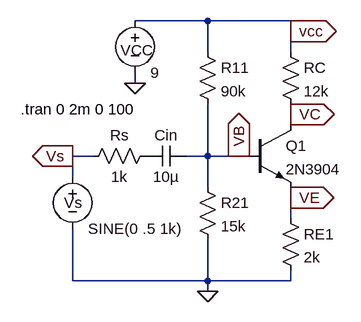
[diagram p0: schematic lab_CE_Q1_stage - GOOD.asc]
lab_CE_Q1_stage - GOOD.asc, the LTspice schematic file:
Version 4
SHEET 1 880 680
WIRE 256 -96 144 -96
WIRE 384 -96 256 -96
WIRE 384 -80 384 -96
WIRE 256 -48 256 -96
WIRE 384 -48 384 -80
WIRE 144 0 144 -16
WIRE 384 48 384 32
WIRE 384 64 384 48
WIRE 80 112 48 112
WIRE 256 112 256 32
WIRE 256 112 224 112
WIRE 304 112 256 112
WIRE 320 112 304 112
WIRE 48 144 48 112
WIRE 256 160 256 112
WIRE 384 176 384 160
WIRE 384 208 384 176
WIRE 48 304 48 224
WIRE 256 304 256 240
WIRE 256 304 48 304
WIRE 384 304 384 288
WIRE 384 304 256 304
WIRE 256 320 256 304
FLAG 144 0 0
FLAG 256 320 0
FLAG 304 112 VB
IOPIN 304 112 Out
FLAG 384 176 VE
IOPIN 384 176 Out
FLAG 384 48 VC
IOPIN 384 48 Out
FLAG 384 -80 vcc
IOPIN 384 -80 Out
FLAG 48 112 Vs
IOPIN 48 112 Out
SYMBOL voltage 48 128 R0
WINDOW 0 -13 56 Left 2
WINDOW 123 0 0 Left 0
WINDOW 39 0 0 Left 0
SYMATTR InstName Vs
SYMATTR Value SINE(0 .5 1k)
SYMBOL res 240 -64 R0
SYMATTR InstName R11
SYMATTR Value 90k
SYMBOL res 240 144 R0
SYMATTR InstName R21
SYMATTR Value 15k
SYMBOL npn 320 64 R0
SYMATTR InstName Q1
SYMATTR Value 2N3904
SYMBOL res 368 -64 R0
SYMATTR InstName RC
SYMATTR Value 12k
SYMBOL res 368 192 R0
SYMATTR InstName RE1
SYMATTR Value 2k
SYMBOL res 176 96 R90
WINDOW 0 0 56 VBottom 2
WINDOW 3 32 56 VTop 2
SYMATTR InstName Rs
SYMATTR Value 1k
SYMBOL cap 224 96 R90
WINDOW 0 0 32 VBottom 2
WINDOW 3 32 32 VTop 2
SYMATTR InstName Cin
SYMATTR Value 10µ
SYMBOL voltage 144 -112 R0
WINDOW 0 -22 61 Left 2
SYMATTR InstName VCC
SYMATTR Value 9
TEXT -32 40 Left 2 !.tran 0 2m 0 100

The netlist it stands for:
* lab_CE_Q1_stage - GOOD.asc
Vs Vs 0 SINE(0 .5 1k)
R11 vcc VB 90k
R21 VB 0 15k
Q1 VC VB VE 0 2N3904
RC vcc VC 12k
RE1 VE 0 2k
Rs P001 Vs 1k
Cin VB P001 10µ
VCC vcc 0 9
.model NPN NPN
.model PNP PNP
.lib standard.bjt
.tran 0 2m 0 100
.backanno
.end